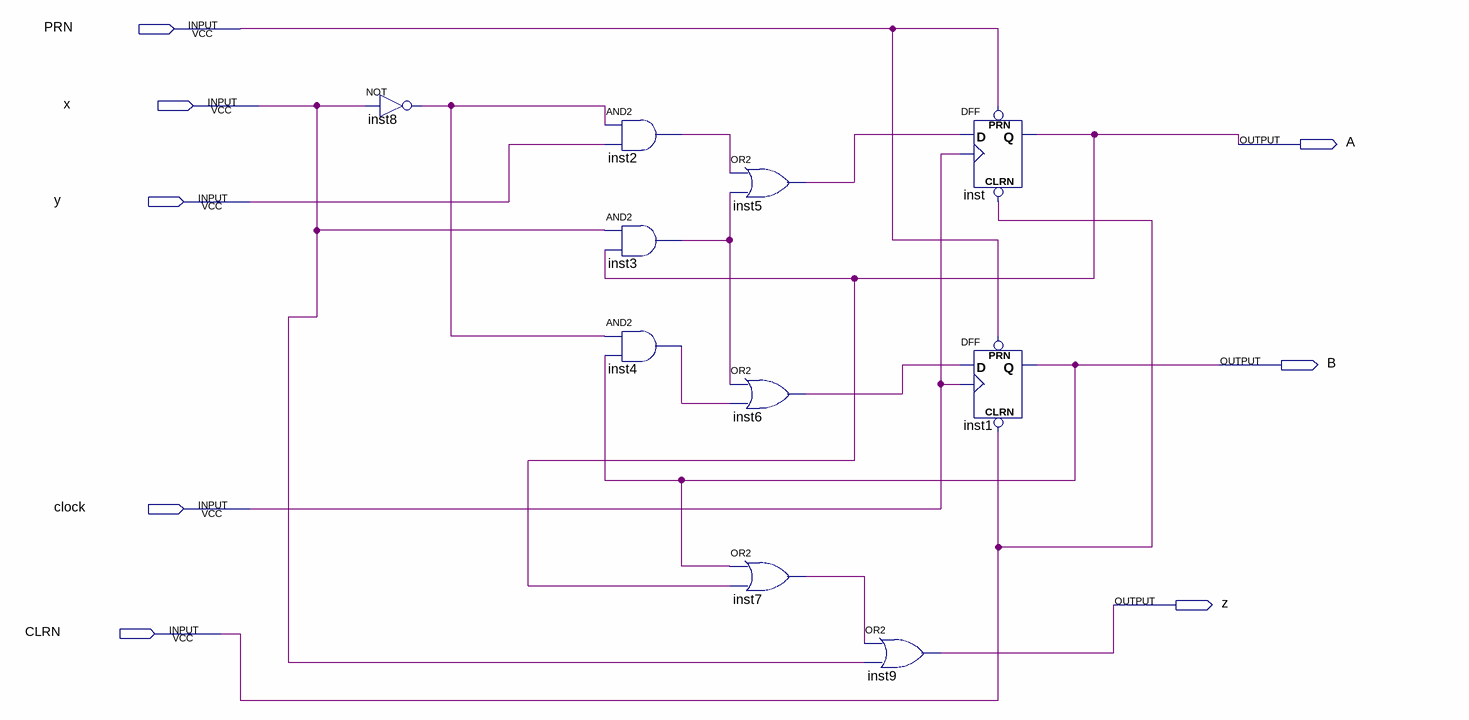
[diagram p0: schematic sheet]
// Quartus schematic diodio.bdf as structural Verilog: 10 symbols, 8 pins
module diodio (
  input  PRN,
  input  x,
  input  y,
  input  clock,
  input  CLRN,
  output A,
  output B,
  output z
);

  wire inst2_out, inst3_out, inst4_out, inst5_out, inst6_out, inst7_out, inst8_out;

  not inst8 (inst8_out, x);
  and inst2 (inst2_out, inst8_out, y);
  and inst3 (inst3_out, x, A);
  and inst4 (inst4_out, inst8_out, B);
  or inst5 (inst5_out, inst2_out, inst3_out);
  or inst6 (inst6_out, inst3_out, inst4_out);
  or inst7 (inst7_out, B, A);
  or inst9 (z, inst7_out, x);
  DFF inst (.CLRN(CLRN), .CLK(clock), .D(inst5_out), .PRN(PRN), .Q(A));
  DFF inst1 (.CLRN(CLRN), .CLK(clock), .D(inst6_out), .PRN(PRN), .Q(B));
endmodule
